# Altium schematic sheet TheEpicCube.SchDoc: The Epic Cube
size B; CompanyName: Smart Home; DrawnBy: Levi Balling; Engineer: Levi Balling; Organization: U of U Computer Engineering; Address1: 50 S. Central Campus Dr.; Address2: Rm. 3280 MEB; Address3: Salt Lake City, UT; Address4: Australia 2086; DocumentNumber: 1; Revision: 1; SheetNumber: 1; SheetTotal: 13; Website: www.eng.utah.edu/~lballing/SmartHome; Project: Smart Home; DocumentName: Title Page; ProjectName: Smart Home
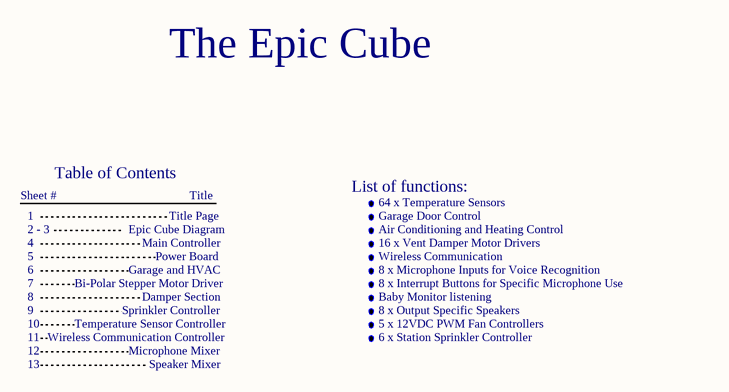
[diagram p0: TheEpicCube.SchDoc]

## Notes on the sheet
- The Epic Cube
- Sheet #
- 1
- Table of Contents
- Title Page
- Title
- List of functions:
- 64 x Temperature Sensors
- Garage Door Control
- 2 - 3
- 4
- 5
- 6
- 7
- Bi-Polar Stepper Motor Driver
- Epic Cube Diagram
- Garage and HVAC
- Main Controller
- Power Board
- Air Conditioning and Heating Control
- 16 x Vent Damper Motor Drivers
- Wireless Communication
- 8 x Microphone Inputs for Voice Recognition
- 8 x Interrupt Buttons for Specific Microphone Use
- 8
- 9
- 10
- 11
- 12
- Wireless Communication Controller
- Temperature Sensor Controller
- Sprinkler Controller
- Microphone Mixer
- Damper Section
- Baby Monitor listening
- 8 x Output Specific Speakers
- 5 x 12VDC PWM Fan Controllers
- 6 x Station Sprinkler Controller
- 13
- Speaker Mixer
- Date:
- Time:
- Engineer:
- Drawn By:
- Checked By:
- Size:
- File:
- B
- Number:
- Revision:
- Project:
- Sheet
- of
- Website: